# Altium project BCD CLOCK.PrjPcb
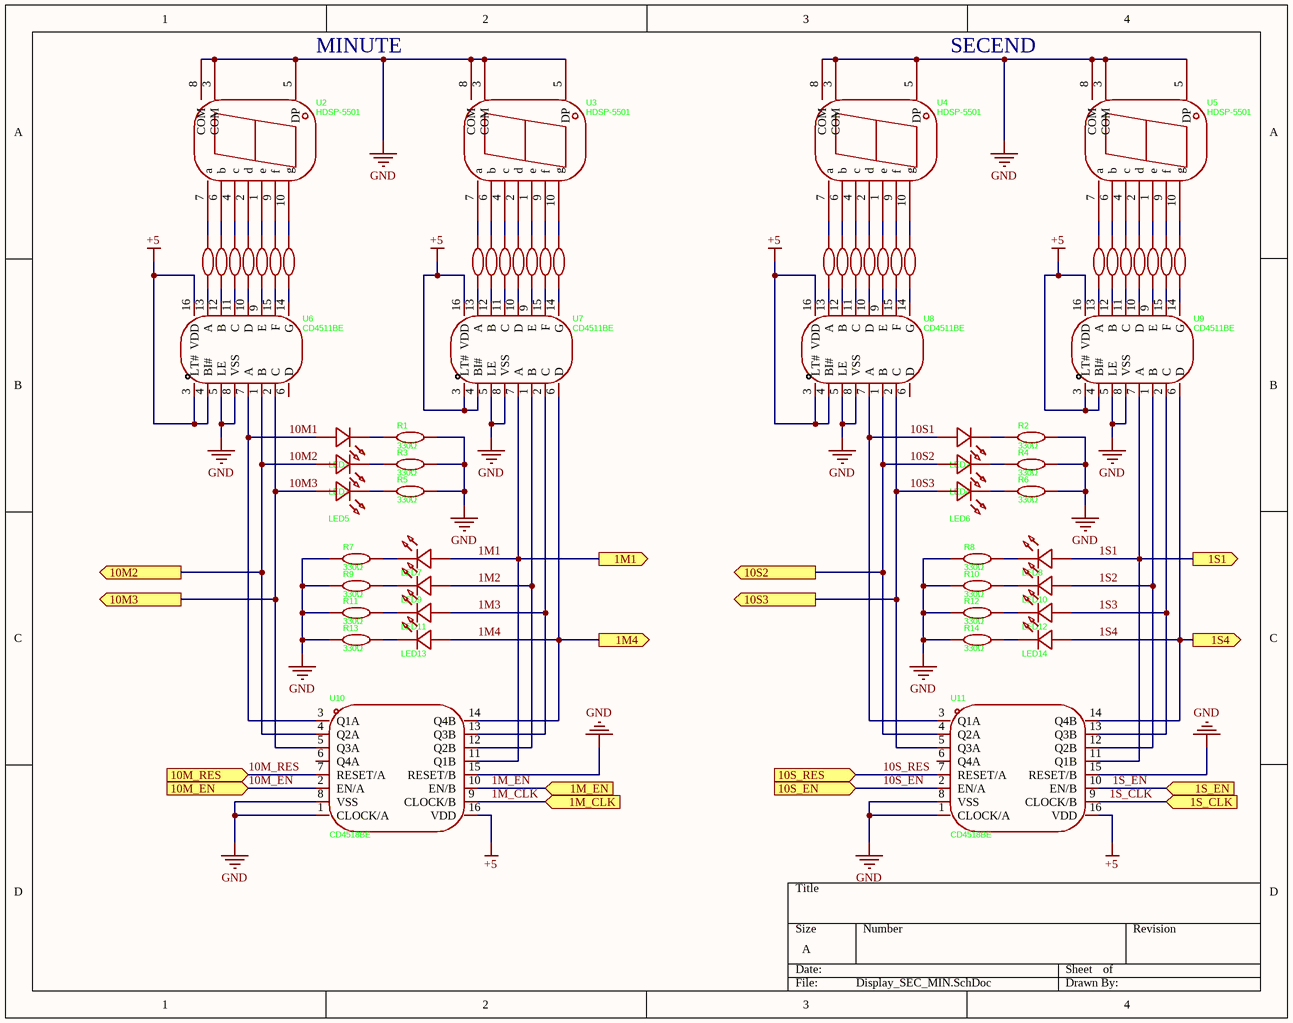
[diagram p0: Display_SEC_MIN.SchDoc]
3 sheets, 137 parts. Net scope: flat (ports and power ports of the same name join across sheets).
Board files: PCB_v2.0.PcbDoc, PCB_v1.0.PcbDoc
Sheets:
  Display_SEC_MIN.SchDoc
  Display_Hour.SchDoc
  CLK_SW.SchDoc

## Sheet Display_SEC_MIN.SchDoc
size A; SheetNumber: 1; SheetTotal: 3

### Parts
LED1  WP7113ID  [LED-TH_BD5.0-P2.54-FD]  (value not drawn)
LED2  WP7113ID  [LED-TH_BD5.0-P2.54-FD]  (value not drawn)
LED3  WP7113ID  [LED-TH_BD5.0-P2.54-FD]  (value not drawn)
LED4  WP7113ID  [LED-TH_BD5.0-P2.54-FD]  (value not drawn)
LED5  WP7113ID  [LED-TH_BD5.0-P2.54-FD]  (value not drawn)
LED6  WP7113ID  [LED-TH_BD5.0-P2.54-FD]  (value not drawn)
LED7  WP7113ID  [LED-TH_BD5.0-P2.54-FD]  (value not drawn)
LED8  WP7113ID  [LED-TH_BD5.0-P2.54-FD]  (value not drawn)
LED9  WP7113ID  [LED-TH_BD5.0-P2.54-FD]  (value not drawn)
LED10  WP7113ID  [LED-TH_BD5.0-P2.54-FD]  (value not drawn)
LED11  WP7113ID  [LED-TH_BD5.0-P2.54-FD]  (value not drawn)
LED12  WP7113ID  [LED-TH_BD5.0-P2.54-FD]  (value not drawn)
LED13  WP7113ID  [LED-TH_BD5.0-P2.54-FD]  (value not drawn)
LED14  WP7113ID  [LED-TH_BD5.0-P2.54-FD]  (value not drawn)
R1  330Ω  [RES-TH_BD2.3-L6.5-P10.50-D0.5]
R2  330Ω  [RES-TH_BD2.3-L6.5-P10.50-D0.5]
R3  330Ω  [RES-TH_BD2.3-L6.5-P10.50-D0.5]
R4  330Ω  [RES-TH_BD2.3-L6.5-P10.50-D0.5]
R5  330Ω  [RES-TH_BD2.3-L6.5-P10.50-D0.5]
R6  330Ω  [RES-TH_BD2.3-L6.5-P10.50-D0.5]
R7  330Ω  [RES-TH_BD2.3-L6.5-P10.50-D0.5]
R8  330Ω  [RES-TH_BD2.3-L6.5-P10.50-D0.5]
R9  330Ω  [RES-TH_BD2.3-L6.5-P10.50-D0.5]
R10  330Ω  [RES-TH_BD2.3-L6.5-P10.50-D0.5]
R11  330Ω  [RES-TH_BD2.3-L6.5-P10.50-D0.5]
R12  330Ω  [RES-TH_BD2.3-L6.5-P10.50-D0.5]
R13  330Ω  [RES-TH_BD2.3-L6.5-P10.50-D0.5]
R14  330Ω  [RES-TH_BD2.3-L6.5-P10.50-D0.5]
R30  330Ω  [RES-TH_BD2.3-L6.5-P10.50-D0.5]  (value not drawn)
R31  330Ω  [RES-TH_BD2.3-L6.5-P10.50-D0.5]  (value not drawn)
R32  330Ω  [RES-TH_BD2.3-L6.5-P10.50-D0.5]  (value not drawn)
R33  330Ω  [RES-TH_BD2.3-L6.5-P10.50-D0.5]  (value not drawn)
R34  330Ω  [RES-TH_BD2.3-L6.5-P10.50-D0.5]  (value not drawn)
R35  330Ω  [RES-TH_BD2.3-L6.5-P10.50-D0.5]  (value not drawn)
R36  330Ω  [RES-TH_BD2.3-L6.5-P10.50-D0.5]  (value not drawn)
R37  330Ω  [RES-TH_BD2.3-L6.5-P10.50-D0.5]  (value not drawn)
R38  330Ω  [RES-TH_BD2.3-L6.5-P10.50-D0.5]  (value not drawn)
R39  330Ω  [RES-TH_BD2.3-L6.5-P10.50-D0.5]  (value not drawn)
R40  330Ω  [RES-TH_BD2.3-L6.5-P10.50-D0.5]  (value not drawn)
R41  330Ω  [RES-TH_BD2.3-L6.5-P10.50-D0.5]  (value not drawn)
R42  330Ω  [RES-TH_BD2.3-L6.5-P10.50-D0.5]  (value not drawn)
R43  330Ω  [RES-TH_BD2.3-L6.5-P10.50-D0.5]  (value not drawn)
R44  330Ω  [RES-TH_BD2.3-L6.5-P10.50-D0.5]  (value not drawn)
R45  330Ω  [RES-TH_BD2.3-L6.5-P10.50-D0.5]  (value not drawn)
R46  330Ω  [RES-TH_BD2.3-L6.5-P10.50-D0.5]  (value not drawn)
R47  330Ω  [RES-TH_BD2.3-L6.5-P10.50-D0.5]  (value not drawn)
R48  330Ω  [RES-TH_BD2.3-L6.5-P10.50-D0.5]  (value not drawn)
R49  330Ω  [RES-TH_BD2.3-L6.5-P10.50-D0.5]  (value not drawn)
R50  330Ω  [RES-TH_BD2.3-L6.5-P10.50-D0.5]  (value not drawn)
R51  330Ω  [RES-TH_BD2.3-L6.5-P10.50-D0.5]  (value not drawn)
R52  330Ω  [RES-TH_BD2.3-L6.5-P10.50-D0.5]  (value not drawn)
R53  330Ω  [RES-TH_BD2.3-L6.5-P10.50-D0.5]  (value not drawn)
R54  330Ω  [RES-TH_BD2.3-L6.5-P10.50-D0.5]  (value not drawn)
R55  330Ω  [RES-TH_BD2.3-L6.5-P10.50-D0.5]  (value not drawn)
R56  330Ω  [RES-TH_BD2.3-L6.5-P10.50-D0.5]  (value not drawn)
R57  330Ω  [RES-TH_BD2.3-L6.5-P10.50-D0.5]  (value not drawn)
U2  HDSP-5501  [LED-SEG-TH_HDSP-A]
U3  HDSP-5501  [LED-SEG-TH_HDSP-A]
U4  HDSP-5501  [LED-SEG-TH_HDSP-A]
U5  HDSP-5501  [LED-SEG-TH_HDSP-A]
U6  CD4511BE  [DIP-16_L19.8-W6.5-P2.54-LS7.6-BL]
U7  CD4511BE  [DIP-16_L19.8-W6.5-P2.54-LS7.6-BL]
U8  CD4511BE  [DIP-16_L19.8-W6.5-P2.54-LS7.6-BL]
U9  CD4511BE  [DIP-16_L19.8-W6.5-P2.54-LS7.6-BL]
U10  CD4518BE  [DIP-16_L19.3-W6.4-P2.54-LS7.6-BL]
U11  CD4518BE  [DIP-16_L19.3-W6.4-P2.54-LS7.6-BL]

### Ports
1M1 (out, see Display_Hour[2A]), 1M4 (out, see Display_Hour[2A]), 1M_CLK (in, see Display_Hour[1A]), 1M_EN (in, see Display_Hour[1C]), 1S1 (out, see Display_Hour[1A]), 1S4 (out, see Display_Hour[1A]), 1S_CLK (in, see Display_Hour[2B]), 1S_EN (in, see Display_Hour[1D]), 10M2 (out, see Display_Hour[2A]), 10M3 (out, see Display_Hour[2A]), 10M_EN (in, see Display_Hour[3B]), 10M_RES (in, see Display_Hour[2A]), 10S2 (out, see Display_Hour[1A]), 10S3 (out, see Display_Hour[1A]), 10S_EN (in, see Display_Hour[1A]), 10S_RES (in, see Display_Hour[1A])

### Nets
+5: U6.3(LT#) U6.4(BI#) U6.16(VDD) U7.3(LT#) U7.4(BI#) U7.16(VDD) U8.3(LT#) U8.4(BI#) U8.16(VDD) U9.3(LT#) U9.4(BI#) U9.16(VDD) U10.16(VDD) U11.16(VDD)
GND: R1.2 R2.2 R3.2 R4.2 R5.2 R6.2 R7.1 R8.1 R9.1 R10.1 R11.1 R12.1 R13.1 R14.1 U2.3(COM) U2.5(DP) U2.8(COM) U3.3(COM) U3.5(DP) U3.8(COM) U4.3(COM) U4.5(DP) U4.8(COM) U5.3(COM) U5.5(DP) U5.8(COM) U6.5(LE) U6.8(VSS) U7.5(LE) U7.8(VSS) U8.5(LE) U8.8(VSS) U9.5(LE) U9.8(VSS) U10.1(CLOCK/A) U10.8(VSS) U10.15(RESET/B) U11.1(CLOCK/A) U11.8(VSS) U11.15(RESET/B)
1M1: LED7.1(A) U7.7(A) U10.11(Q1B) ; port 1M1
1M2: LED9.1(A) U7.1(B) U10.12(Q2B)
1M3: LED11.1(A) U7.2(C) U10.13(Q3B)
1M4: LED13.1(A) U7.6(D) U10.14(Q4B) ; port 1M4
1M_EN: U10.10(EN/B) ; port 1M_EN
1S1: LED8.1(A) U9.7(A) U11.11(Q1B) ; port 1S1
1S2: LED10.1(A) U9.1(B) U11.12(Q2B)
1S3: LED12.1(A) U9.2(C) U11.13(Q3B)
1S4: LED14.1(A) U9.6(D) U11.14(Q4B) ; port 1S4
1S_CLK: U11.9(CLOCK/B) ; port 1S_CLK
1S_EN: U11.10(EN/B) ; port 1S_EN
10M1: LED1.1(A) U6.7(A) U10.3(Q1A)
10M2: LED3.1(A) U6.1(B) U10.4(Q2A) ; port 10M2
10M3: LED5.1(A) U6.2(C) U10.5(Q3A) ; port 10M3
10M_EN: U10.2(EN/A) ; port 10M_EN
10M_RES: U10.7(RESET/A) ; port 10M_RES
10S1: LED2.1(A) U8.7(A) U11.3(Q1A)
10S2: LED4.1(A) U8.1(B) U11.4(Q2A) ; port 10S2
10S3: LED6.1(A) U8.2(C) U11.5(Q3A) ; port 10S3
10S_EN: U11.2(EN/A) ; port 10S_EN
10S_RES: U10.9(CLOCK/B) U11.7(RESET/A) ; port 10S_RES, port 1M_CLK  [also labelled 1M_CLK]
NetLED1_2: LED1.2(K) R1.1
NetLED2_2: LED2.2(K) R2.1
NetLED3_2: LED3.2(K) R3.1
NetLED4_2: LED4.2(K) R4.1
NetLED5_2: LED5.2(K) R5.1
NetLED6_2: LED6.2(K) R6.1
NetLED7_2: LED7.2(K) R7.2
NetLED8_2: LED8.2(K) R8.2
NetLED9_2: LED9.2(K) R9.2
NetLED10_2: LED10.2(K) R10.2
NetLED11_2: LED11.2(K) R11.2
NetLED12_2: LED12.2(K) R12.2
NetLED13_2: LED13.2(K) R13.2
NetLED14_2: LED14.2(K) R14.2
NetR30_1: R30.1 U6.13(A)
NetR30_2: R30.2 U2.7(a)
NetR31_1: R31.1 U6.12(B)
NetR31_2: R31.2 U2.6(b)
NetR32_1: R32.1 U6.11(C)
NetR32_2: R32.2 U2.4(c)
NetR33_1: R33.1 U6.10(D)
NetR33_2: R33.2 U2.2(d)
NetR34_1: R34.1 U6.9(E)
NetR34_2: R34.2 U2.1(e)
NetR35_1: R35.1 U6.15(F)
NetR35_2: R35.2 U2.9(f)
NetR36_1: R36.1 U6.14(G)
NetR36_2: R36.2 U2.10(g)
NetR37_1: R37.1 U7.13(A)
NetR37_2: R37.2 U3.7(a)
NetR38_1: R38.1 U7.12(B)
NetR38_2: R38.2 U3.6(b)
NetR39_1: R39.1 U7.11(C)
NetR39_2: R39.2 U3.4(c)
NetR40_1: R40.1 U7.10(D)
NetR40_2: R40.2 U3.2(d)
NetR41_1: R41.1 U7.9(E)
NetR41_2: R41.2 U3.1(e)
NetR42_1: R42.1 U7.15(F)
NetR42_2: R42.2 U3.9(f)
NetR43_1: R43.1 U7.14(G)
NetR43_2: R43.2 U3.10(g)
NetR44_1: R44.1 U8.13(A)
NetR44_2: R44.2 U4.7(a)
NetR45_1: R45.1 U8.12(B)
NetR45_2: R45.2 U4.6(b)
NetR46_1: R46.1 U8.11(C)
NetR46_2: R46.2 U4.4(c)
NetR47_1: R47.1 U8.10(D)
NetR47_2: R47.2 U4.2(d)
NetR48_1: R48.1 U8.9(E)
NetR48_2: R48.2 U4.1(e)
NetR49_1: R49.1 U8.15(F)
NetR49_2: R49.2 U4.9(f)
NetR50_1: R50.1 U8.14(G)
NetR50_2: R50.2 U4.10(g)
NetR51_1: R51.1 U9.13(A)
NetR51_2: R51.2 U5.7(a)
NetR52_1: R52.1 U9.12(B)
NetR52_2: R52.2 U5.6(b)
NetR53_1: R53.1 U9.11(C)
NetR53_2: R53.2 U5.4(c)
NetR54_1: R54.1 U9.10(D)
NetR54_2: R54.2 U5.2(d)
NetR55_1: R55.1 U9.9(E)
NetR55_2: R55.2 U5.1(e)
NetR56_1: R56.1 U9.15(F)
NetR56_2: R56.2 U5.9(f)
NetR57_1: R57.1 U9.14(G)
NetR57_2: R57.2 U5.10(g)

Not connected (* = marked no-connect by the designer): U6 6(D); U8 6(D); U10 6(Q4A); U11 6(Q4A)

### Notes on the sheet
- (near U2) MINUTE
- (near U4) SECEND

### Library data of the parts
LED1-LED14 = D_LED_2mm_red: Manufacturer: Kingbright; Add into BOM: yes; Emitted Color: Red; Forward Voltage (VF): 2V; Forward Current: 20mA; Dominant Wavelength: 617nm; Peak Wavelength: 627nm; Lens Color: Red Lens; Luminous Intensity: 40mcd; Viewing Angle: 30°; Symbol: WP7113ID; Device: WP7113ID; LCSC Part Name: WP7113ID; Supplier Part: C6926004; Manufacturer Part: WP7113ID; Supplier Footprint: 插件,D=5mm; JLCPCB Part Class: Extended Part; Datasheet: https://atta.szlcsc.com/upload/public/pdf/source/20241101/124CAE47E7911E6EBC0B1714F77DAFC6.pdf; Supplier: LCSC; Convert to PCB: yes
R1-R14 R30-R57 = Reg_330R_0.25W: Manufacturer: CCO(千志电子); Symbol: MF1/4W-330Ω±1% T52; Device: MF1/4W-330Ω±1% T; Add into BOM: yes; Tolerance: ±1%; Voltage-Supply(Max): 250V; Power(Watts): 250mW; Temperature Coefficient: ±100ppm/℃; LCSC Part Name: 330Ω ±1% 250mW 金属膜电阻; Supplier Part: C119313; Manufacturer Part: MF1/4W-330Ω±1% T; Supplier Footprint: 插件,D2.3xL6.5mm; JLCPCB Part Class: Extended Part; Datasheet: https://atta.szlcsc.com/upload/public/pdf/source/20190910/C427326_62A6D058BC0FF74963A2F22379CA06CE.pdf; Supplier: LCSC; Convert to PCB: yes; Type: Metal Film Resistors; Value: 330Ω; Operating Temperature: -55℃~+155℃
U2-U5 = HDSP-5501: Manufacturer: Broadcom/AVAGO(安华高); Symbol: HDSP-5501_C18198807; Add into BOM: yes; Device: HDSP-5501_C18198807; LCSC Part Name: HDSP-5501; Supplier Part: C18198807; Manufacturer Part: HDSP-5501; Supplier Footprint: 插件; JLCPCB Part Class: Extended Part; Datasheet: https://atta.szlcsc.com/upload/public/pdf/source/20230925/D6197A9C41D1E502B523821274CC57EA.pdf; Supplier: LCSC; Convert to PCB: yes
U6-U9 = CD4511BE_C507153: Manufacturer: HGSEMI(华冠); Add into BOM: yes; Symbol: CD4511BE_C507153; Device: CD4511BE_C507153; LCSC Part Name: CMOS BCD 到 7 段 LED 锁存解码器驱动器; Supplier Part: C507153; Manufacturer Part: CD4511BE; Supplier Footprint: DIP-16; JLCPCB Part Class: Extended Part; Datasheet: https://atta.szlcsc.com/upload/public/pdf/source/20220513/69A3CD8936477BC6706446B8F2E34C07.pdf; Supplier: LCSC; Convert to PCB: yes
U10 U11 = CD4518BE: Manufacturer: TI(德州仪器); Add into BOM: yes; Logic Type: BCDCounter; Direction: Rising Edge；Falling Edge; Voltage - Supply: 3V~18V; Number of Elements: 2; Reset: Asynchronous; Timing: Synchronous; Count Rate: 8MHz; Symbol: CD4518BE; Device: CD4518BE; LCSC Part Name: CD4518BE; Supplier Part: C5220; Manufacturer Part: CD4518BE; Supplier Footprint: DIP-16; JLCPCB Part Class: Extended Part; Datasheet: https://www.ti.com/cn/lit/gpn/cd4518b; Supplier: LCSC; Convert to PCB: yes; Operating Temperature: -55℃~+125℃

## Sheet Display_Hour.SchDoc
size A; SheetNumber: 2; SheetTotal: 3
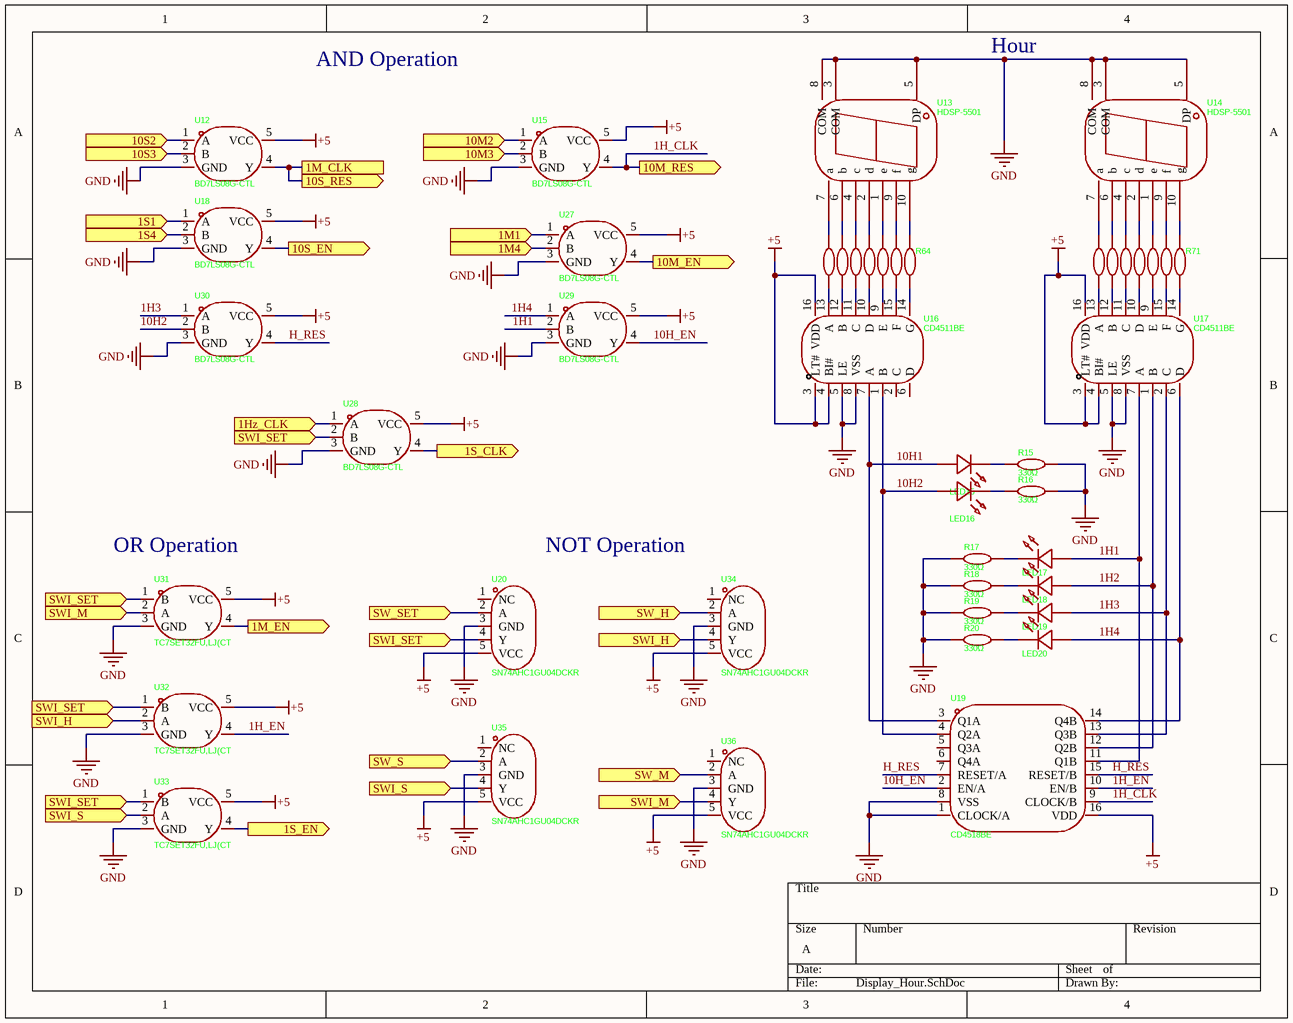
[diagram p1: Display_Hour.SchDoc]

### Parts
LED15  WP7113ID  [LED-TH_BD5.0-P2.54-FD]  (value not drawn)
LED16  WP7113ID  [LED-TH_BD5.0-P2.54-FD]  (value not drawn)
LED17  WP7113ID  [LED-TH_BD5.0-P2.54-FD]  (value not drawn)
LED18  WP7113ID  [LED-TH_BD5.0-P2.54-FD]  (value not drawn)
LED19  WP7113ID  [LED-TH_BD5.0-P2.54-FD]  (value not drawn)
LED20  WP7113ID  [LED-TH_BD5.0-P2.54-FD]  (value not drawn)
R15  330Ω  [RES-TH_BD2.3-L6.5-P10.50-D0.5]
R16  330Ω  [RES-TH_BD2.3-L6.5-P10.50-D0.5]
R17  330Ω  [RES-TH_BD2.3-L6.5-P10.50-D0.5]
R18  330Ω  [RES-TH_BD2.3-L6.5-P10.50-D0.5]
R19  330Ω  [RES-TH_BD2.3-L6.5-P10.50-D0.5]
R20  330Ω  [RES-TH_BD2.3-L6.5-P10.50-D0.5]
R58  330Ω  [RES-TH_BD2.3-L6.5-P10.50-D0.5]  (value not drawn)
R59  330Ω  [RES-TH_BD2.3-L6.5-P10.50-D0.5]  (value not drawn)
R60  330Ω  [RES-TH_BD2.3-L6.5-P10.50-D0.5]  (value not drawn)
R61  330Ω  [RES-TH_BD2.3-L6.5-P10.50-D0.5]  (value not drawn)
R62  330Ω  [RES-TH_BD2.3-L6.5-P10.50-D0.5]  (value not drawn)
R63  330Ω  [RES-TH_BD2.3-L6.5-P10.50-D0.5]  (value not drawn)
R64  330Ω  [RES-TH_BD2.3-L6.5-P10.50-D0.5]  (value not drawn)
R65  330Ω  [RES-TH_BD2.3-L6.5-P10.50-D0.5]  (value not drawn)
R66  330Ω  [RES-TH_BD2.3-L6.5-P10.50-D0.5]  (value not drawn)
R67  330Ω  [RES-TH_BD2.3-L6.5-P10.50-D0.5]  (value not drawn)
R68  330Ω  [RES-TH_BD2.3-L6.5-P10.50-D0.5]  (value not drawn)
R69  330Ω  [RES-TH_BD2.3-L6.5-P10.50-D0.5]  (value not drawn)
R70  330Ω  [RES-TH_BD2.3-L6.5-P10.50-D0.5]  (value not drawn)
R71  330Ω  [RES-TH_BD2.3-L6.5-P10.50-D0.5]  (value not drawn)
U12  BD7LS08G-CTL  [SSOP-5_L3.0-W1.6-P0.95-LS2.8-BR]
U13  HDSP-5501  [LED-SEG-TH_HDSP-A]
U14  HDSP-5501  [LED-SEG-TH_HDSP-A]
U15  BD7LS08G-CTL  [SSOP-5_L3.0-W1.6-P0.95-LS2.8-BR]
U16  CD4511BE  [DIP-16_L19.8-W6.5-P2.54-LS7.6-BL]
U17  CD4511BE  [DIP-16_L19.8-W6.5-P2.54-LS7.6-BL]
U18  BD7LS08G-CTL  [SSOP-5_L3.0-W1.6-P0.95-LS2.8-BR]
U19  CD4518BE  [DIP-16_L19.3-W6.4-P2.54-LS7.6-BL]
U20  SN74AHC1GU04DCKR  [SOT-353_L2.1-W1.3-P0.65-LS2.3-BR]
U27  BD7LS08G-CTL  [SSOP-5_L3.0-W1.6-P0.95-LS2.8-BR]
U28  BD7LS08G-CTL  [SSOP-5_L3.0-W1.6-P0.95-LS2.8-BR]
U29  BD7LS08G-CTL  [SSOP-5_L3.0-W1.6-P0.95-LS2.8-BR]
U30  BD7LS08G-CTL  [SSOP-5_L3.0-W1.6-P0.95-LS2.8-BR]
U31  TC7SET32FU,LJ(CT  [TSSOP-5_L2.0-W1.3-P0.65-LS2.1-BR]
U32  TC7SET32FU,LJ(CT  [TSSOP-5_L2.0-W1.3-P0.65-LS2.1-BR]
U33  TC7SET32FU,LJ(CT  [TSSOP-5_L2.0-W1.3-P0.65-LS2.1-BR]
U34  SN74AHC1GU04DCKR  [SOT-353_L2.1-W1.3-P0.65-LS2.3-BR]
U35  SN74AHC1GU04DCKR  [SOT-353_L2.1-W1.3-P0.65-LS2.3-BR]
U36  SN74AHC1GU04DCKR  [SOT-353_L2.1-W1.3-P0.65-LS2.3-BR]

### Ports
1Hz_CLK (in, see CLK_SW[4C]), 1M1 (in, see Display_SEC_MIN[2C]), 1M4 (in, see Display_SEC_MIN[2C]), 1M_CLK (see Display_SEC_MIN[2D]), 1M_EN (out, see Display_SEC_MIN[2D]), 1S1 (in, see Display_SEC_MIN[4C]), 1S4 (in, see Display_SEC_MIN[4C]), 1S_CLK (out, see Display_SEC_MIN[4D]), 1S_EN (out, see Display_SEC_MIN[4D]), 10M2 (in, see Display_SEC_MIN[1C]), 10M3 (in, see Display_SEC_MIN[1C]), 10M_EN (out, see Display_SEC_MIN[1D]), 10M_RES (out, see Display_SEC_MIN[1D]), 10S2 (in, see Display_SEC_MIN[3C]), 10S3 (in, see Display_SEC_MIN[3C]), 10S_EN (out, see Display_SEC_MIN[3D]), 10S_RES (out, see Display_SEC_MIN[3D]), SW_H (in, see CLK_SW[2C]), SW_M (in, see CLK_SW[2B]), SW_S (in, see CLK_SW[2A]), SW_SET (in, see CLK_SW[2D]), SWI_H (in, see Display_Hour[1C]), SWI_H (in, see Display_Hour[2C]), SWI_M (in, see Display_Hour[1C]), SWI_M (in, see Display_Hour[2D]), SWI_S (in, see Display_Hour[1D]), SWI_S (in, see Display_Hour[2D]), SWI_SET (in, see Display_Hour[1B], Display_Hour[1C], Display_Hour[1D]), SWI_SET (in, see Display_Hour[1B], Display_Hour[1C], Display_Hour[1D], Display_Hour[2C]), SWI_SET (in, see Display_Hour[1B], Display_Hour[1C], Display_Hour[2C]), SWI_SET (in, see Display_Hour[1C], Display_Hour[1D], Display_Hour[2C])

### Nets
+5: U12.5(VCC) U15.5(VCC) U16.3(LT#) U16.4(BI#) U16.16(VDD) U17.3(LT#) U17.4(BI#) U17.16(VDD) U18.5(VCC) U19.16(VDD) U20.5(VCC) U27.5(VCC) U28.5(VCC) U29.5(VCC) U30.5(VCC) U31.5(VCC) U32.5(VCC) U33.5(VCC) U34.5(VCC) U35.5(VCC) U36.5(VCC)
GND: R15.2 R16.2 R17.1 R18.1 R19.1 R20.1 U12.3(GND) U13.3(COM) U13.5(DP) U13.8(COM) U14.3(COM) U14.5(DP) U14.8(COM) U15.3(GND) U16.5(LE) U16.8(VSS) U17.5(LE) U17.8(VSS) U18.3(GND) U19.1(CLOCK/A) U19.8(VSS) U20.3(GND) U27.3(GND) U28.3(GND) U29.3(GND) U30.3(GND) U31.3(GND) U32.3(GND) U33.3(GND) U34.3(GND) U35.3(GND) U36.3(GND)
1H1: LED17.1(A) U17.7(A) U19.11(Q1B) U29.2(B)
1H2: LED18.1(A) U17.1(B) U19.12(Q2B)
1H3: LED19.1(A) U17.2(C) U19.13(Q3B) U30.1(A)
1H4: LED20.1(A) U17.6(D) U19.14(Q4B) U29.1(A)
1H_CLK: U15.4(Y) U19.9(CLOCK/B) ; port 10M_RES  [project net 10M_RES]
1H_EN: U19.10(EN/B) U32.4(Y)
1M1: U27.1(A) ; port 1M1
1M4: U27.2(B) ; port 1M4
1M_EN: U31.4(Y) ; port 1M_EN
1S1: U18.1(A) ; port 1S1
1S4: U18.2(B) ; port 1S4
1S_CLK: U28.4(Y) ; port 1S_CLK
1S_EN: U33.4(Y) ; port 1S_EN
10H1: LED15.1(A) U16.7(A) U19.3(Q1A)
10H2: LED16.1(A) U16.1(B) U19.4(Q2A) U30.2(B)
10H_EN: U19.2(EN/A) U29.4(Y)
10M2: U15.1(A) ; port 10M2
10M3: U15.2(B) ; port 10M3
10M_EN: U27.4(Y) ; port 10M_EN
10S2: U12.1(A) ; port 10S2
10S3: U12.2(B) ; port 10S3
10S_EN: U18.4(Y) ; port 10S_EN
10S_RES: U12.4(Y) ; port 10S_RES, port 1M_CLK
H_RES: U19.7(RESET/A) U19.15(RESET/B) U30.4(Y)
NetC1_2: U35.2(A) ; port SW_S
NetC2_2: U36.2(A) ; port SW_M
NetC3_2: U34.2(A) ; port SW_H
NetC6_2: U20.2(A) ; port SW_SET
NetLED15_2: LED15.2(K) R15.1
NetLED16_2: LED16.2(K) R16.1
NetLED17_2: LED17.2(K) R17.2
NetLED18_2: LED18.2(K) R18.2
NetLED19_2: LED19.2(K) R19.2
NetLED20_2: LED20.2(K) R20.2
NetR58_1: R58.1 U16.13(A)
NetR58_2: R58.2 U13.7(a)
NetR59_1: R59.1 U16.12(B)
NetR59_2: R59.2 U13.6(b)
NetR60_1: R60.1 U16.11(C)
NetR60_2: R60.2 U13.4(c)
NetR61_1: R61.1 U16.10(D)
NetR61_2: R61.2 U13.2(d)
NetR62_1: R62.1 U16.9(E)
NetR62_2: R62.2 U13.1(e)
NetR63_1: R63.1 U16.15(F)
NetR63_2: R63.2 U13.9(f)
NetR64_1: R64.1 U16.14(G)
NetR64_2: R64.2 U13.10(g)
NetR65_1: R65.1 U17.13(A)
NetR65_2: R65.2 U14.7(a)
NetR66_1: R66.1 U17.12(B)
NetR66_2: R66.2 U14.6(b)
NetR67_1: R67.1 U17.11(C)
NetR67_2: R67.2 U14.4(c)
NetR68_1: R68.1 U17.10(D)
NetR68_2: R68.2 U14.2(d)
NetR69_1: R69.1 U17.9(E)
NetR69_2: R69.2 U14.1(e)
NetR70_1: R70.1 U17.15(F)
NetR70_2: R70.2 U14.9(f)
NetR71_1: R71.1 U17.14(G)
NetR71_2: R71.2 U14.10(g)
NetU20_4: U20.4(Y) U28.2(B) U31.1(B) U32.1(B) U33.1(B) ; port SWI_SET
NetU25_1: U28.1(A) ; port 1Hz_CLK
NetU31_2: U31.2(A) U36.4(Y) ; port SWI_M
NetU32_2: U32.2(A) U34.4(Y) ; port SWI_H
NetU33_2: U33.2(A) U35.4(Y) ; port SWI_S

Not connected (* = marked no-connect by the designer): U16 2(C) 6(D); U19 5(Q3A) 6(Q4A); U20 1(NC); U34 1(NC); U35 1(NC); U36 1(NC)

### Notes on the sheet
- AND Operation
- Hour
- (near U31) OR Operation
- NOT Operation

### Library data of the parts
LED15-LED20 = D_LED_2mm_red: as LED1 on sheet Display_SEC_MIN; Symbol: WP7113ID; Device: WP7113ID; LCSC Part Name: WP7113ID; Supplier Part: C6926004; Manufacturer Part: WP7113ID; Supplier Footprint: 插件,D=5mm; JLCPCB Part Class: Extended Part; Datasheet: https://atta.szlcsc.com/upload/public/pdf/source/20241101/124CAE47E7911E6EBC0B1714F77DAFC6.pdf; Supplier: LCSC; Convert to PCB: yes
R15-R20 R58-R71 = Reg_330R_0.25W: as R1 on sheet Display_SEC_MIN; LCSC Part Name: 330Ω ±1% 250mW 金属膜电阻; Supplier Part: C119313; Manufacturer Part: MF1/4W-330Ω±1% T; Supplier Footprint: 插件,D2.3xL6.5mm; JLCPCB Part Class: Extended Part; Datasheet: https://atta.szlcsc.com/upload/public/pdf/source/20190910/C427326_62A6D058BC0FF74963A2F22379CA06CE.pdf; Supplier: LCSC; Convert to PCB: yes; Type: Metal Film Resistors; Value: 330Ω; Operating Temperature: -55℃~+155℃
U12 U15 U18 U27-U30 = AND_BD7LS08G-CTL: Manufacturer: ROHM(罗姆); Add into BOM: yes; Logic Gate Type: 与门; Number of Channels: 1; Supply Voltage: 1.65V~5.5V; Quiescent Current (Max): 10uA; Sink Current: 32mA; Propagation Delay Time: 10ns@5V,50pF; Symbol: BD7LS08G-CTL; Device: BD7LS08G-CTL; LCSC Part Name: BD7LS08G-CTL; Supplier Part: C4471342; Manufacturer Part: BD7LS08G-CTL; Supplier Footprint: SSOP-5; JLCPCB Part Class: Extended Part; Supplier: LCSC; Convert to PCB: yes; Source Current: 32mA; Operating Temperature: -40℃~+125℃
U13 U14 = HDSP-5501: as U2 on sheet Display_SEC_MIN; Device: HDSP-5501_C18198807; LCSC Part Name: HDSP-5501; Supplier Part: C18198807; Manufacturer Part: HDSP-5501; Supplier Footprint: 插件; JLCPCB Part Class: Extended Part; Datasheet: https://atta.szlcsc.com/upload/public/pdf/source/20230925/D6197A9C41D1E502B523821274CC57EA.pdf; Supplier: LCSC; Convert to PCB: yes
U16 U17 = CD4511BE_C507153: as U6 on sheet Display_SEC_MIN; Symbol: CD4511BE_C507153; Device: CD4511BE_C507153; LCSC Part Name: CMOS BCD 到 7 段 LED 锁存解码器驱动器; Supplier Part: C507153; Manufacturer Part: CD4511BE; Supplier Footprint: DIP-16; JLCPCB Part Class: Extended Part; Datasheet: https://atta.szlcsc.com/upload/public/pdf/source/20220513/69A3CD8936477BC6706446B8F2E34C07.pdf; Supplier: LCSC; Convert to PCB: yes
U19 = CD4518BE: as U10 on sheet Display_SEC_MIN; Symbol: CD4518BE; Device: CD4518BE; LCSC Part Name: CD4518BE; Supplier Part: C5220; Manufacturer Part: CD4518BE; Supplier Footprint: DIP-16; JLCPCB Part Class: Extended Part; Datasheet: https://www.ti.com/cn/lit/gpn/cd4518b; Supplier: LCSC; Convert to PCB: yes; Operating Temperature: -55℃~+125℃
U20 U34-U36 = NOT_SN74AHC1GU04DCKR_C7472: Manufacturer: TI(德州仪器); Add into BOM: yes; Supply Voltage(Single): 2V~5.5V; Supply Current (Max): 1uA; Number of Circuits: 1; Sink Current: 8mA; High level range (VIH): 1.7V~4.4V; Low level range (VIL): 300mV~1.1V; Max Propagation Delay: 7ns@5V,50pF; Symbol: SN74AHC1GU04DCKR_C7472; Device: SN74AHC1GU04DCKR_C7472; LCSC Part Name: 单路反相器; Supplier Part: C7472; Manufacturer Part: SN74AHC1GU04DCKR; Supplier Footprint: SOT-353; JLCPCB Part Class: Extended Part; Datasheet: https://www.ti.com/cn/lit/gpn/sn74ahc1gu04; Supplier: LCSC; Convert to PCB: yes; Input Type: -; Number of Inputs: 1; Source Current: 8mA; Series: 74AHCSeries; Operating Temperature: -40℃~+85℃
U31-U33 = OR_GATE_TC7SET32FU,LJ(CT: Manufacturer: TOSHIBA(东芝); Add into BOM: yes; Logic Gate Type: ORGate; Number of Channels: 1; Supply Voltage: 4.5V~5.5V; Quiescent Current (Max): 2uA; Sink Current: 8mA; High Level Range (VIH): 2V; Low Level Range (VIL): 800mV; Propagation Delay Time: 9ns@5V,50pF; Symbol: TC7SET32FU,LJ(CT; Device: TC7SET32FU,LJ(CT; LCSC Part Name: TC7SET32FU,LJ(CT; Supplier Part: C7360615; Manufacturer Part: TC7SET32FU,LJ(CT; Supplier Footprint: SSOP-5; JLCPCB Part Class: Extended Part; Datasheet: https://atta.szlcsc.com/upload/public/pdf/source/231023/inline-d04b01c8ac5c233d4c0f3d416dbdd867.pdf; Supplier: LCSC; Convert to PCB: yes; Source Current: 8mA; Series: TC7SETSeries; Operating Temperature: -40℃~+85℃

## Sheet CLK_SW.SchDoc
size A; SheetNumber: 3; SheetTotal: 3
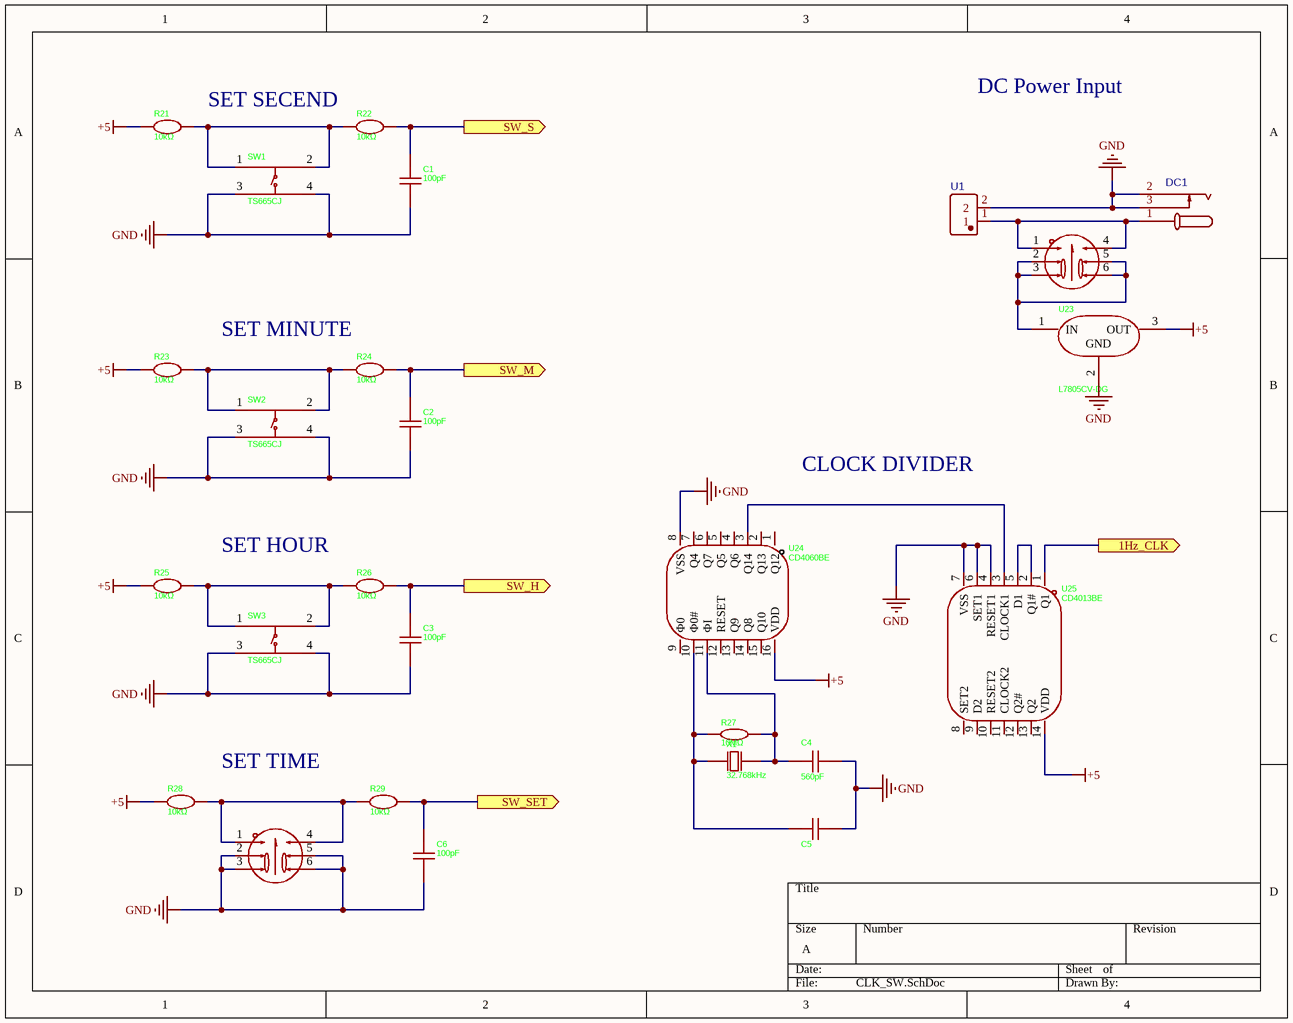
[diagram p2: CLK_SW.SchDoc]

### Parts
C1  100pF  [CAP-TH_L5.0-W3.0-P5.00-D0.6-S2.45]
C2  100pF  [CAP-TH_L5.0-W3.0-P5.00-D0.6-S2.45]
C3  100pF  [CAP-TH_L5.0-W3.0-P5.00-D0.6-S2.45]
C4  560pF  [CAP-TH_L8.5-W3.0-P5.00-D0.6-S2.5]
C5  22pF  [CAP-TH_L7.4-W4.0-P6.40-D0.5-S1.00]  (value not drawn)
C6  100pF  [CAP-TH_L5.0-W3.0-P5.00-D0.6-S2.45]
DC1  DC-005-2.5A-2.0  [CONN-TH_DC-005-2.5A-2.0]  (value not drawn)
R21  10kΩ  [RES-TH_BD2.4-L6.3-P10.30-D0.6]
R22  10kΩ  [RES-TH_BD2.4-L6.3-P10.30-D0.6]
R23  10kΩ  [RES-TH_BD2.4-L6.3-P10.30-D0.6]
R24  10kΩ  [RES-TH_BD2.4-L6.3-P10.30-D0.6]
R25  10kΩ  [RES-TH_BD2.4-L6.3-P10.30-D0.6]
R26  10kΩ  [RES-TH_BD2.4-L6.3-P10.30-D0.6]
R27  10MΩ  [RES-TH_BD2.2-L6.5-P10.50-D0.6]
R28  10kΩ  [RES-TH_BD2.4-L6.3-P10.30-D0.6]
R29  10kΩ  [RES-TH_BD2.4-L6.3-P10.30-D0.6]
SW1  TS665CJ  [SW-TH_4P-L6.0-W6.0-P4.50-LS6.5]
SW2  TS665CJ  [SW-TH_4P-L6.0-W6.0-P4.50-LS6.5]
SW3  TS665CJ  [SW-TH_4P-L6.0-W6.0-P4.50-LS6.5]
U1  DBT50G-7.62-2P  [CONN-TH_2P-P7.62_L15.2-W16.7-EX4.2]  (value not drawn)
U22  PS-7054DVB-6PL  [SW-TH_6P-L7.0-W7.0-P2.00]  (value not drawn)
U23  L7805CV-DG  [TO-220-3_L10.0-W4.5-P2.54-L]
U24  CD4060BE  [DIP-16_L19.8-W6.5-P2.54-LS7.6-BL]
U25  CD4013BE  [DIP-14_L19.2-W6.6-P2.54-LS10.9-BL]
U26  PS-7054DVB-6PL  [SW-TH_6P-L7.0-W7.0-P2.00]  (value not drawn)
X1  32.768kHz  [OSC-TH_BD3.1-P0.8-D0.3]

### Ports
1Hz_CLK (out, see Display_Hour[1B]), SW_H (out, see Display_Hour[2C]), SW_M (out, see Display_Hour[2D]), SW_S (out, see Display_Hour[2C]), SW_SET (out, see Display_Hour[2C])

### Nets
+5: R21.2 R23.2 R25.2 R28.2 U23.3(OUT) U24.16(VDD) U25.14(VDD)
GND: C1.1 C2.1 C3.1 C4.1 C5.1 C6.1 DC1.2 DC1.3 SW1.3(C) SW1.4(D) SW2.3(C) SW2.4(D) SW3.3(C) SW3.4(D) U1.2 U23.2(GND) U24.8(VSS) U25.4(RESET1) U25.6(SET1) U25.7(VSS) U26.2 U26.3 U26.5 U26.6
NetC1_2: C1.2 R22.1 ; port SW_S
NetC2_2: C2.2 R24.1 ; port SW_M
NetC3_2: C3.2 R26.1 ; port SW_H
NetC4_2: C4.2 R27.1 U24.11(ΦI) X1.2(OSC2)
NetC5_2: C5.2 R27.2 U24.10(Φ0#) X1.1(OSC1)
NetC6_2: C6.2 R29.1 ; port SW_SET
NetDC1_1: DC1.1 U1.1 U22.1 U22.4
NetR21_1: R21.1 R22.2 SW1.1(A) SW1.2(B)
NetR23_1: R23.1 R24.2 SW2.1(A) SW2.2(B)
NetR25_1: R25.1 R26.2 SW3.1(A) SW3.2(B)
NetR28_1: R28.1 R29.2 U26.1 U26.4
NetU22_2: U22.2 U22.3 U22.5 U22.6 U23.1(IN)
NetU24_3: U24.3(Q14) U25.3(CLOCK1)
NetU25_1: U25.1(Q1) ; port 1Hz_CLK
NetU25_2: U25.2(Q1#) U25.5(D1)

Not connected (* = marked no-connect by the designer): U24 1(Q12) 2(Q13) 4(Q6) 5(Q5) 6(Q7) 7(Q4) 9(Φ0) 12(RESET) 13(Q9) 14(Q8) 15(Q10); U25 8(SET2) 9(D2) 10(RESET2) 11(CLOCK2) 12(Q2#) 13(Q2)

### Notes on the sheet
- DC Power Input
- SET SECEND
- SET MINUTE
- CLOCK DIVIDER
- SET HOUR
- (near R28) SET TIME

### Library data of the parts
C1-C3 C6 = Cap_100pF_50V_ceramic: Manufacturer: SHM(南方宏明); Symbol: DCT101K20Y5PF6FJ5A0; Add into BOM: yes; Tolerance: ±10%; Voltage Rating: 50V; Pin Spacing: 5mm; Temperature Coefficient: Y5P; Device: DCT101K20Y5PF6FJ5A0; LCSC Part Name: 100pF ±10% 50V; Supplier Part: C2896026; Manufacturer Part: DCT101K20Y5PF6FJ5A0; Supplier Footprint: 插件,P=5mm; JLCPCB Part Class: Extended Part; Datasheet: https://atta.szlcsc.com/upload/public/pdf/source/20210929/C4FEE90C41821237A84737C21615A4EC.pdf; Supplier: LCSC; Convert to PCB: yes; Value: 100pF
C4 = Cap_560pF_50V_ceraic: Manufacturer: SHM(南方宏明); Symbol: DCC561J34SL F6FJ5A0; Add into BOM: yes; Tolerance: ±5%; Voltage Rating: 50V; Pin Spacing: 5mm; Temperature Coefficient: SL; Device: DCC561J34SL F6FJ5A0; LCSC Part Name: 560pF ±5% 50V; Supplier Part: C2896138; Manufacturer Part: DCC561J34SL F6FJ5A0; Supplier Footprint: 插件,P=5mm; JLCPCB Part Class: Extended Part; Datasheet: https://atta.szlcsc.com/upload/public/pdf/source/20210929/2675BE423E96B4772DBF330AE545E239.pdf; Supplier: LCSC; Convert to PCB: yes; Value: 560pF
C5 = Cap_22pF_50V_ceramic: Manufacturer: Dersonic(德尔创); Symbol: CC1H220KA1EDCH4B1100; Add into BOM: yes; Tolerance: ±10%; Voltage Rating: 50V; Pin Spacing: 2.54mm; Temperature Coefficient: NP0; Body Thickness: 2.4mm; Device: CC1H220KA1EDCH4B1100; LCSC Part Name: 22pF ±10% 50V; Supplier Part: C2832510; Manufacturer Part: CC1H220KA1EDCH4B1100; Supplier Footprint: 插件,P=2.54mm; JLCPCB Part Class: Extended Part; Datasheet: https://atta.szlcsc.com/upload/public/pdf/source/20211103/062C09467AB58979163D97626BAD0297.pdf; Supplier: LCSC; Convert to PCB: yes; Value: 22pF; Diameter: 4.8mm
DC1 = DC-005-2.5A-2.0: Manufacturer: XKB Connection(中国星坤); Contributor: LCSC; Supplier: LCSC; Supplier Part: C319099; Manufacturer Part: DC-005-2.5A-2.0; JLCPCB Part Class: Extended Part; spicePre: D; spiceSymbolName: DC-005-2.5A-2.0
R21-R26 R28 R29 = Reg_10k_0.25W: Manufacturer: Tyohm(幸亚电阻); Symbol: RN 1/4W 10K F T/B A1; Device: RN1/4W10KFT/BA1; Add into BOM: yes; Tolerance: ±1%; Overload Voltage (Max): 250V; Power(Watts): 250mW; Temperature Coefficient: ±50ppm/℃; LCSC Part Name: 10kΩ ±1% 250mW 金属膜电阻; Supplier Part: C410695; Manufacturer Part: RN1/4W10KFT/BA1; Supplier Footprint: 插件,D2.4xL6.5mm; JLCPCB Part Class: Extended Part; Datasheet: https://atta.szlcsc.com/upload/public/pdf/source/20190808/C410699_D126E64D28B638F1D73B58E9F61DFD9B.pdf; Supplier: LCSC; Convert to PCB: yes; Type: Metal Film Resistors; Value: 10kΩ; Operating Temperature Range: -55℃~+125℃
R27 = Reg_10M_0.25W: Manufacturer: CCO(千志电子); Symbol: CF1/4W-10MΩ±5%; Device: CF1/4W-10MΩ±5% T; Add into BOM: yes; Tolerance: ±5%; Voltage-Supply(Max): 250V; Power(Watts): 250mW; Temperature Coefficient: -1500ppm/℃~0ppm/℃; LCSC Part Name: 10MΩ ±5% 250mW 碳膜电阻; Supplier Part: C127261; Manufacturer Part: CF1/4W-10MΩ±5% T; Supplier Footprint: 插件,D2.3xL6.5mm; JLCPCB Part Class: Extended Part; Datasheet: https://atta.szlcsc.com/upload/public/pdf/source/20190910/C427328_A0A2D65F3FD547937F4E674C90868175.pdf; Supplier: LCSC; Convert to PCB: yes; Type: Carbon Resister; Value: 10MΩ; Operating Temperature: -55℃~+155℃
SW1-SW3 = TS665CJ: Manufacturer: SHOU HAN(首韩); Add into BOM: yes; Circuit: SPST; Actuator Style: Round Button; Switch Length: 6mm; Switch Height: 5mm; Contact Current: 50mA; Voltage Rating (DC): 12V; Symbol: TS665CJ; Device: TS665CJ; LCSC Part Name: 6*6*5mm 直插 轻触开关; Supplier Part: C393938; Manufacturer Part: TS665CJ; Supplier Footprint: 插件; JLCPCB Part Class: Extended Part; Datasheet: https://atta.szlcsc.com/upload/public/pdf/source/20190521/C393938_BDABEAC600B4C55E200A80AA129B70BC.pdf; Supplier: LCSC; Convert to PCB: yes; Mounting Style: Straight; Switch Width: 6mm; With Lamp: -; Mechanical Life: -
U1 = DBT50G-7.62-2P: Manufacturer: DORABO(地博电气); Manufacturer Part: DBT50G-7.62-2P-BK-P; Contributor: LCSC; Supplier: LCSC; Supplier Part: C496127; JLCPCB Part Class: Extended Part; spicePre: U; spiceSymbolName: DBT50G-7.62-2P
U22 U26 = PS-7054DVB-6PL: Manufacturer: G-Switch(品赞); Add into BOM: yes; Self Lock / No Lock: LATCHING; Operating Force: 250gf; Symbol: PS-7054DVB-6PL; Device: PS-7054DVB-6PL; LCSC Part Name: 7*7自锁按键开关; Supplier Part: C22363819; Manufacturer Part: PS-7054DVB-6PL; Supplier Footprint: 插件-6P,7x7mm; JLCPCB Part Class: Extended Part; Datasheet: https://atta.szlcsc.com/upload/public/pdf/source/20240319/F2B7FB2723231C6F1D5F9BB35EBA5342.pdf; Supplier: LCSC; Convert to PCB: yes
U23 = L7805CV-DG: Manufacturer: ST(意法半导体); Add into BOM: yes; Output Type: Fixed; Maximum Input Voltage: 35V; Output Voltage: 5V; Output Current: 1.5A; Power Supply Rejection Ratio (PSRR): 62dB@(120Hz); Dropout Voltage: 2V@(1A); standby current: 8mA; Output Polarity: Positive electrode; Number of Outputs: 1; Symbol: L7805CV-DG; Device: L7805CV-DG; LCSC Part Name: 正稳压器IC; Supplier Part: C3795; Manufacturer Part: L7805CV-DG; Supplier Footprint: TO-220; JLCPCB Part Class: Extended Part; Datasheet: https://atta.szlcsc.com/upload/public/pdf/source/20140724/1457707163191.pdf; Supplier: LCSC; Convert to PCB: yes; Feature: Short-Circuit  Protection；Thermal Protection(TSD)；Overcurrent Protection(OCP); Operating Temperature: 0℃~+125℃
U24 = CD4060BE: Manufacturer: HGSEMI(华冠); Symbol: CD4060BE_C507159; Add into BOM: yes; Device: CD4060BE; LCSC Part Name: CMOS 14 级纹波进位二进制计数器/除法器和振荡器; Supplier Part: C507159; Manufacturer Part: CD4060BE; Supplier Footprint: DIP-16; JLCPCB Part Class: Extended Part; Datasheet: https://atta.szlcsc.com/upload/public/pdf/source/20200730/C507159_CD40804D6EEA04930EB86D9D2459BFCA.pdf; Supplier: LCSC; Convert to PCB: yes
U25 = CD4013BE: Manufacturer: TI(德州仪器); Add into BOM: yes; Trigger Type: Rising Edge; Voltage - Supply: 3V~18V; Clock Frequency: 24MHz; Function: Positioning and resetting; Number of Elements: 2; Number of Bits per Element: 1; Output Type: Complementary Type; Propagation Delay: 90ns@15V,50pF; Current - Output Low(IOL): 6.8mA; Quiescent Current: 4uA; Input Capacitance: 5pF; Symbol: CD4013BE; Device: CD4013BE; LCSC Part Name: CD4013BE; Supplier Part: C5199; Manufacturer Part: CD4013BE; Supplier Footprint: DIP-14; JLCPCB Part Class: Extended Part; Datasheet: https://www.ti.com/cn/lit/gpn/cd4013b; Supplier: LCSC; Convert to PCB: yes; Type: D-Type; Series: 4000BSeries; Current - Output High(IOH): 6.8mA; Operating Temperature: -55℃~+125℃
X1 = AB38T-32.768KHZ: Manufacturer: ABRACON; Add into BOM: yes; Normal temperature Frequency Tolerance: ±20ppm; Equivalent Series Resistance (ESR): 30kΩ; Symbol: AB38T-32.768KHZ; Device: AB38T-32.768KHZ; LCSC Part Name: 32.768kHz ±20ppm 12.5pF; Supplier Part: C194002; Manufacturer Part: AB38T-32.768KHZ; Supplier Footprint: DT-38; JLCPCB Part Class: Extended Part; Datasheet: https://atta.szlcsc.com/upload/public/pdf/source/20180613/C194002_28532E064E51A8E79CA51D5C8B24387E.pdf; Supplier: LCSC; Convert to PCB: yes; Crystal Type: -; Value: 32.768kHz; Frequency Stability(Full temperature range): -

## Nets that join several sheets
+5: Display_SEC_MIN (14 pins), Display_Hour (21 pins), CLK_SW (7 pins)
GND: Display_SEC_MIN (40 pins), Display_Hour (32 pins), CLK_SW (24 pins)
1M1: Display_SEC_MIN (LED7.1 U7.7 U10.11), Display_Hour (U27.1)
1M4: Display_SEC_MIN (LED13.1 U7.6 U10.14), Display_Hour (U27.2)
1M_EN: Display_SEC_MIN (U10.10), Display_Hour (U31.4)
1S1: Display_SEC_MIN (LED8.1 U9.7 U11.11), Display_Hour (U18.1)
1S4: Display_SEC_MIN (LED14.1 U9.6 U11.14), Display_Hour (U18.2)
1S_CLK: Display_SEC_MIN (U11.9), Display_Hour (U28.4)
1S_EN: Display_SEC_MIN (U11.10), Display_Hour (U33.4)
10M2: Display_SEC_MIN (LED3.1 U6.1 U10.4), Display_Hour (U15.1)
10M3: Display_SEC_MIN (LED5.1 U6.2 U10.5), Display_Hour (U15.2)
10M_EN: Display_SEC_MIN (U10.2), Display_Hour (U27.4)
10M_RES: Display_SEC_MIN (U10.7), Display_Hour (U15.4 U19.9)
10S2: Display_SEC_MIN (LED4.1 U8.1 U11.4), Display_Hour (U12.1)
10S3: Display_SEC_MIN (LED6.1 U8.2 U11.5), Display_Hour (U12.2)
10S_EN: Display_SEC_MIN (U11.2), Display_Hour (U18.4)
10S_RES: Display_SEC_MIN (U10.9 U11.7), Display_Hour (U12.4)
NetC1_2: Display_Hour (U35.2), CLK_SW (C1.2 R22.1)
NetC2_2: Display_Hour (U36.2), CLK_SW (C2.2 R24.1)
NetC3_2: Display_Hour (U34.2), CLK_SW (C3.2 R26.1)
NetC6_2: Display_Hour (U20.2), CLK_SW (C6.2 R29.1)
NetU25_1: Display_Hour (U28.1), CLK_SW (U25.1)